# Altium schematic sheet KeyBoarDisplay.SchDoc
size A2
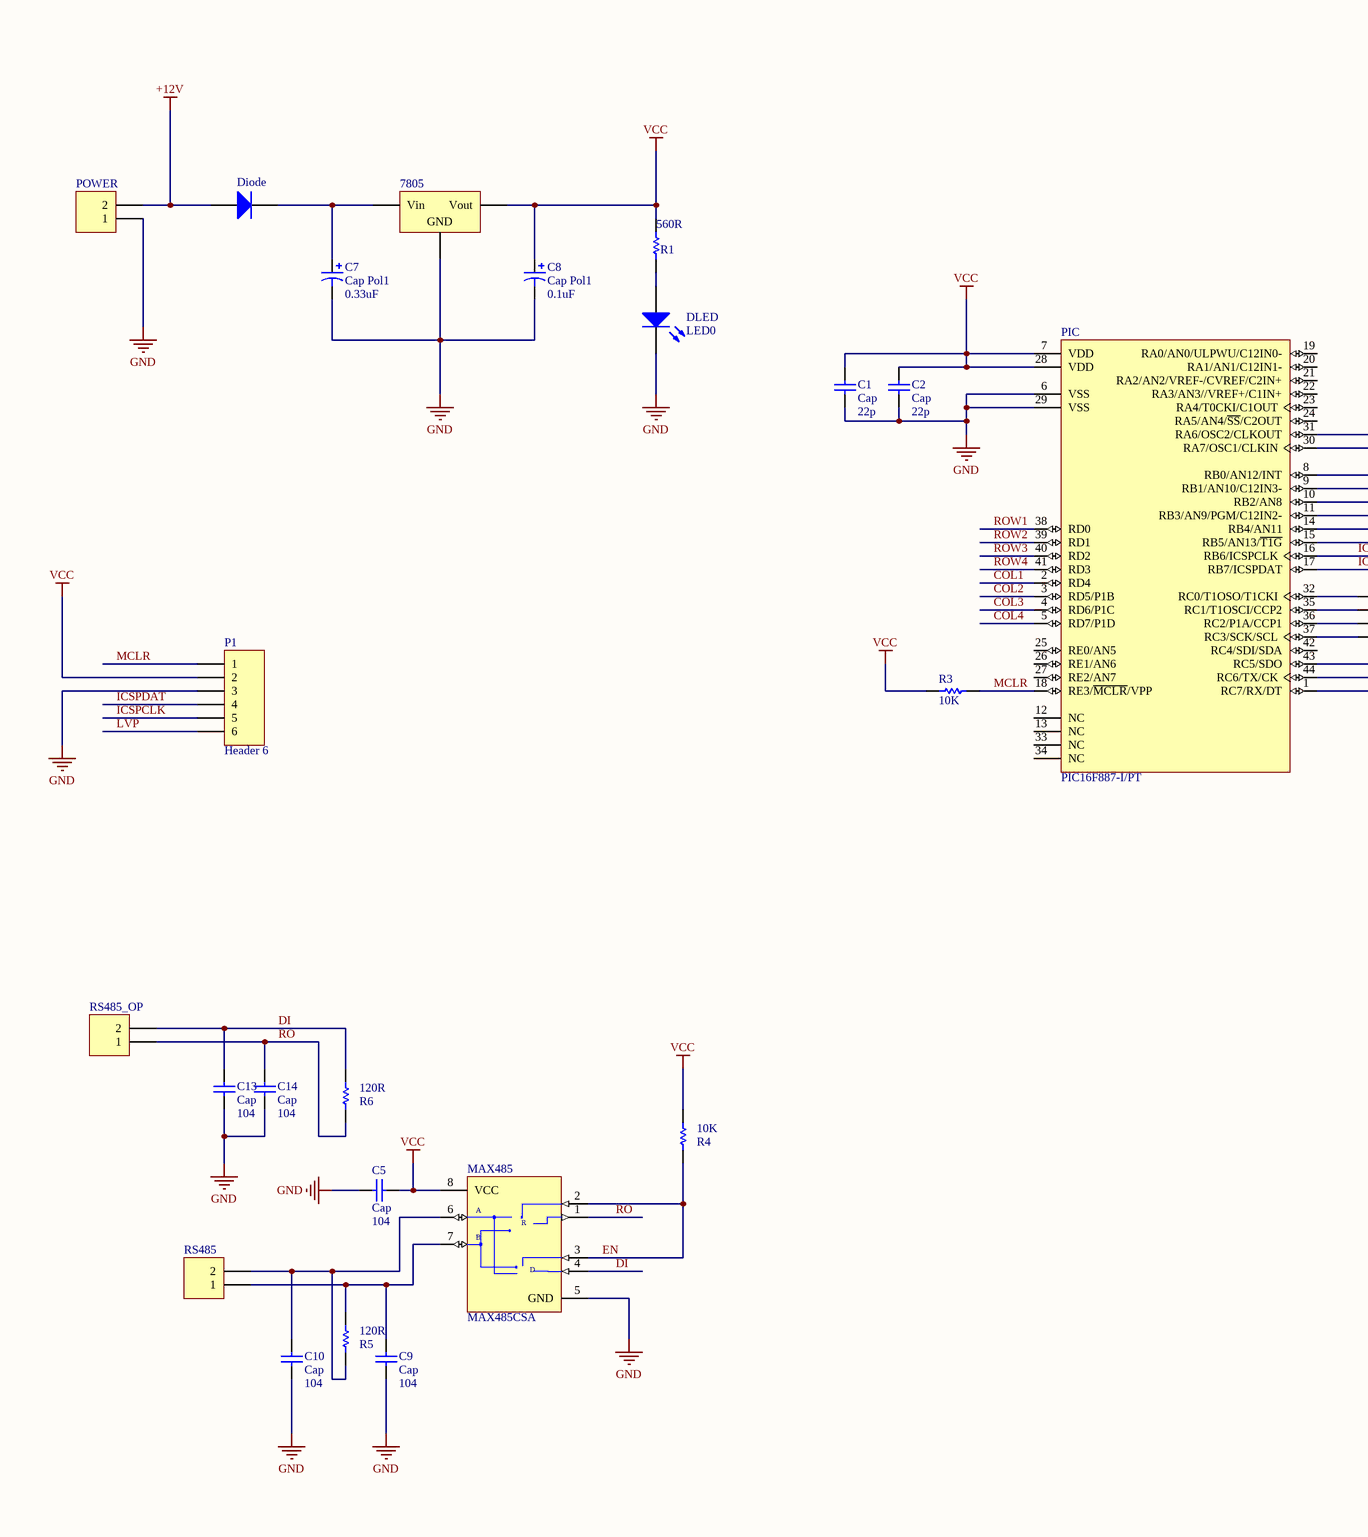
[diagram p0: KeyBoarDisplay.SchDoc, left]
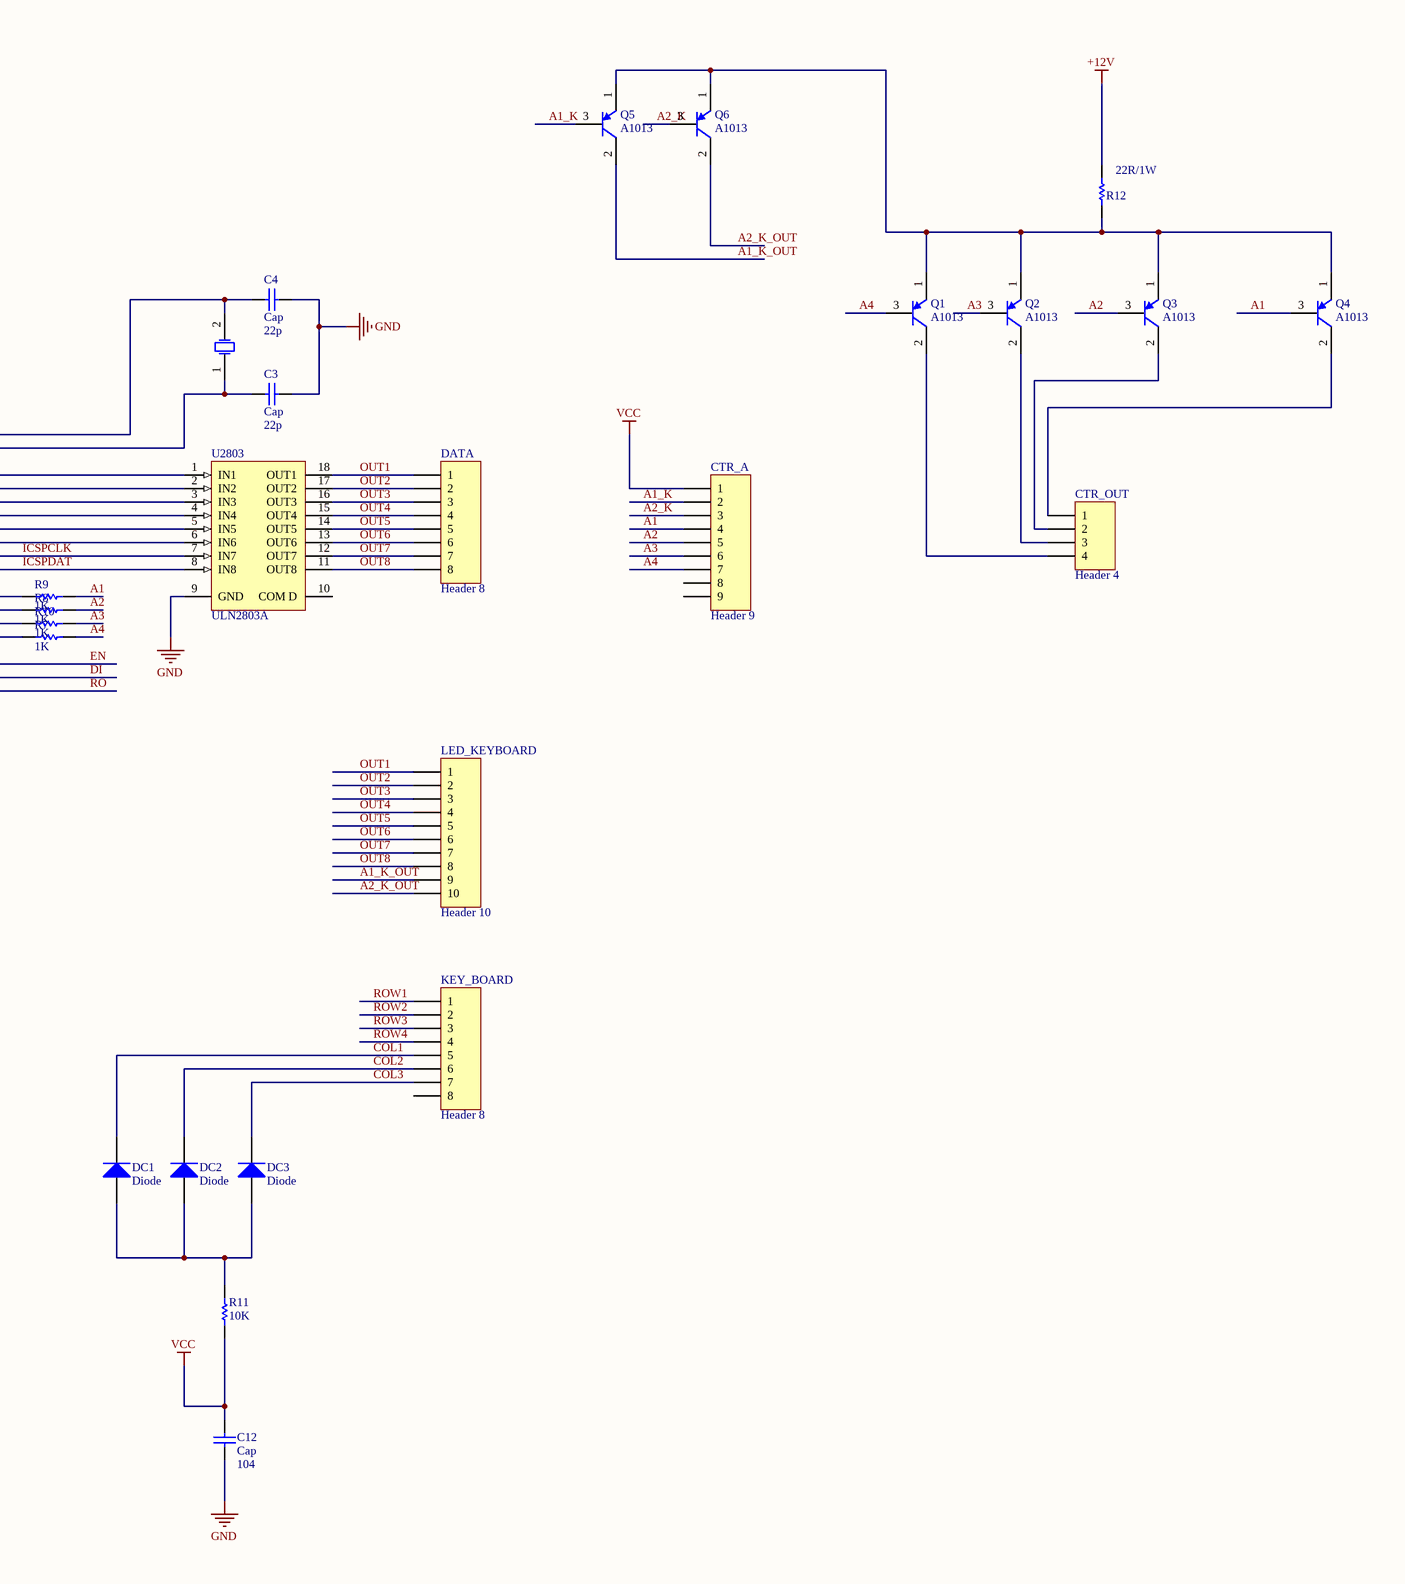
[diagram p1: KeyBoarDisplay.SchDoc, right]

## Parts
7805  Volt Reg  [78xx_NO]  (value not drawn)
?  XTAL  [Xtal12M]  (value not drawn)
C1  Cap  value 22p  [tu_gom]
C2  Cap  value 22p  [tu_gom]
C3  Cap  value 22p  [tu_gom]
C4  Cap  value 22p  [tu_gom]
C5  Cap  value 104  [tu_gom]
C7  Cap Pol1  value 0.33uF  [TU 470uF/50V]
C8  Cap Pol1  value 0.1uF  [tu 100uF/50v]
C9  Cap  value 104  [tu_gom]
C10  Cap  value 104  [tu_gom]
C12  Cap  value 104  [tu_gom]
C13  Cap  value 104  [tu_gom]
C14  Cap  value 104  [tu_gom]
CTR_A  Header 9  [HDR1X9]
CTR_OUT  Header 4  [CAP 4]
DATA  Header 8  [Cap_8]
DC1  Diode  [D_1A]
DC2  Diode  [D_1A]
DC3  Diode  [D_1A]
Diode  Diode  [D_2A]  (value not drawn)
DLED  LED0  [LED_3]
KEY_BOARD  Header 8  [Cap_8]
LED_KEYBOARD  Header 10  [CAP_10]
MAX485  MAX485CSA  [NSO8_N]
P1  Header 6  [HDR1X6]
PIC  PIC16F887-I/PT  [TQFP-PT44_N]
POWER  Header 2  [Header2 - duplicate]  (value not drawn)
Q1  A1013  [A1013]
Q2  A1013  [A1013]
Q3  A1013  [A1013]
Q4  A1013  [A1013]
Q5  A1013  [A1013]
Q6  A1013  [A1013]
R1  560R  [R_Nor]
R3  10K  [R_Nor]
R4  10K  [R_Nor]
R5  120R  [R_Nor]
R6  120R  [R_Nor]
R7  1K  [R_Nor]
R8  1K  [R_Nor]
R9  1K  [R_Nor]
R10  1K  [R_Nor]
R11  10K  [R_Nor]
R12  22R/1W  [R_CS220/470/1W]
RS485  Header 2  [Header2 - duplicate]  (value not drawn)
RS485_OP  Header 2  [Header2 - duplicate]  (value not drawn)
U2803  ULN2803A  [DIP18]

## Nets
+12V: Diode.1(A) POWER.2 R12.2
GND: 7805.2(GND) C1.1 C2.1 C3.2 C4.2 C5.1 C7.2 C8.2 C9.1 C10.1 C12.1 C13.1 C14.1 DLED.2(K) MAX485.5(GND) P1.3 PIC.6(VSS) PIC.29(VSS) POWER.1 U2803.9(GND)
VCC: 7805.3(Vout) C1.2 C2.2 C5.2 C8.1 C12.2 CTR_A.1 MAX485.8(VCC) P1.2 PIC.7(VDD) PIC.28(VDD) R1.2 R3.2 R4.2 R11.2
A1: CTR_A.4 Q4.3(B) R9.2
A1_K: CTR_A.2 Q5.3(B)
A1_K_OUT: LED_KEYBOARD.9 Q5.2(C)
A2: CTR_A.5 Q3.3(B) R8.2
A2_K: CTR_A.3 Q6.3(B)
A2_K_OUT: LED_KEYBOARD.10 Q6.2(C)
A3: CTR_A.6 Q2.3(B) R10.2
A4: CTR_A.7 Q1.3(B) R7.2
COL1: DC1.2(K) KEY_BOARD.5 PIC.2(RD4)
COL2: DC2.2(K) KEY_BOARD.6 PIC.3(RD5/P1B)
COL3: DC3.2(K) KEY_BOARD.7 PIC.4(RD6/P1C)
COL4: PIC.5(RD7/P1D)
DI: C13.2 MAX485.4(DI) PIC.44(RC6/TX/CK) R6.2 RS485_OP.2
EN: MAX485.2(~{RE}) MAX485.3(DE) PIC.43(RC5/SDO) R4.1
ICSPCLK: P1.5 PIC.16(RB6/ICSPCLK) U2803.7(IN7)
ICSPDAT: P1.4 PIC.17(RB7/ICSPDAT) U2803.8(IN8)
LVP: P1.6
MCLR: P1.1 PIC.18(RE3/~{MCLR}/VPP) R3.1
OUT1: DATA.1 LED_KEYBOARD.1 U2803.18(OUT1)
OUT2: DATA.2 LED_KEYBOARD.2 U2803.17(OUT2)
OUT3: DATA.3 LED_KEYBOARD.3 U2803.16(OUT3)
OUT4: DATA.4 LED_KEYBOARD.4 U2803.15(OUT4)
OUT5: DATA.5 LED_KEYBOARD.5 U2803.14(OUT5)
OUT6: DATA.6 LED_KEYBOARD.6 U2803.13(OUT6)
OUT7: DATA.7 LED_KEYBOARD.7 U2803.12(OUT7)
OUT8: DATA.8 LED_KEYBOARD.8 U2803.11(OUT8)
RO: C14.2 MAX485.1(RO) PIC.1(RC7/RX/DT) R6.1 RS485_OP.1
ROW1: KEY_BOARD.1 PIC.38(RD0)
ROW2: KEY_BOARD.2 PIC.39(RD1)
ROW3: KEY_BOARD.3 PIC.40(RD2)
ROW4: KEY_BOARD.4 PIC.41(RD3)
Net7805_1: 7805.1(Vin) C7.1 Diode.2(K)
Net?_1: ?.1(OSC1) C3.1 PIC.30(RA7/OSC1/CLKIN)
Net?_2: ?.2(OSC2) C4.1 PIC.31(RA6/OSC2/CLKOUT)
NetC9_2: C9.2 MAX485.7(B) R5.2 RS485.1
NetC10_2: C10.2 MAX485.6(A) R5.1 RS485.2
NetCTR_OUT_1: CTR_OUT.1 Q4.2(C)
NetCTR_OUT_2: CTR_OUT.2 Q3.2(C)
NetCTR_OUT_3: CTR_OUT.3 Q2.2(C)
NetCTR_OUT_4: CTR_OUT.4 Q1.2(C)
NetDC1_1: DC1.1(A) DC2.1(A) DC3.1(A) R11.1
NetDLED_1: DLED.1(A) R1.1
NetPIC_8: PIC.8(RB0/AN12/INT) U2803.1(IN1)
NetPIC_9: PIC.9(RB1/AN10/C12IN3-) U2803.2(IN2)
NetPIC_10: PIC.10(RB2/AN8) U2803.3(IN3)
NetPIC_11: PIC.11(RB3/AN9/PGM/C12IN2-) U2803.4(IN4)
NetPIC_14: PIC.14(RB4/AN11) U2803.5(IN5)
NetPIC_15: PIC.15(RB5/AN13/~{T1G}) U2803.6(IN6)
NetPIC_32: PIC.32(RC0/T1OSO/T1CKI) R9.1
NetPIC_35: PIC.35(RC1/T1OSCI/CCP2) R8.1
NetPIC_36: PIC.36(RC2/P1A/CCP1) R10.1
NetPIC_37: PIC.37(RC3/SCK/SCL) R7.1
NetQ1_1: Q1.1(E) Q2.1(E) Q3.1(E) Q4.1(E) Q5.1(E) Q6.1(E) R12.1

Not connected (* = marked no-connect by the designer): CTR_A 8 9; KEY_BOARD 8; PIC 12(NC) 13(NC) 19(RA0/AN0/ULPWU/C12IN0-) 20(RA1/AN1/C12IN1-) 21(RA2/AN2/VREF-/CVREF/C2IN+) 22(RA3/AN3//VREF+/C1IN+) 23(RA4/T0CKI/C1OUT) 24(RA5/AN4/~{SS}/C2OUT) 25(RE0/AN5) 26(RE1/AN6) 27(RE2/AN7) 33(NC) 34(NC) 42(RC4/SDI/SDA); U2803 10(COM_D)

## Notes on the sheet
- (in symbol MAX485CSA) R; D

## Library data of the parts
7805 = Volt Reg: Voltage Regulator; Published: 24-Mar-1999; LatestRevisionDate: 29-May-2009; LatestRevisionNote: IPC-7351 Footprint Added.; PackageReference: D2PAK; Publisher: Altium Limited; PackageDescription: 3-Pin Transistor Outline Package 2.54 mm Pitch, 15.1 mm Lead Span
? = XTAL: Crystal Oscillator; Published: 8-Jun-2000; LatestRevisionDate: 17-Jul-2002; LatestRevisionNote: Re-released for DXP Platform.; PackageReference: R38; Publisher: Altium Limited
C1-C5 C9 C10 C12-C14 = Ceramic: Capcitor
C7 C8 = Cap Pol1: Polarized Capacitor (Radial); Published: 8-Jun-2000; LatestRevisionDate: 17-Jul-2002; LatestRevisionNote: Re-released for DXP Platform.; PackageReference: RB7.6-15; Publisher: Altium Limited
CTR_A = Header 9: Header, 9-Pin; LatestRevisionDate: 17-Jul-2002; LatestRevisionNote: Re-released for DXP Platform.; Publisher: Altium Limited
CTR_OUT = Header 4: Header, 4-Pin; LatestRevisionDate: 17-Jul-2002; LatestRevisionNote: Re-released for DXP Platform.; Publisher: Altium Limited
DATA KEY_BOARD = Header 8: Header, 8-Pin; LatestRevisionDate: 17-Jul-2002; LatestRevisionNote: Re-released for DXP Platform.; Publisher: Altium Limited
DC1-DC3 Diode = Diode: Default Diode; Published: 8-Jun-2000; LatestRevisionDate: 17-Jul-2002; LatestRevisionNote: Re-released for DXP Platform.; PackageVersion: Sep-1996; PackageReference: SMC; Publisher: Altium Limited; Code_JEDEC: DO-214-AB
DLED = LED0: Typical INFRARED GaAs LED; Published: 8-Jun-2000; LatestRevisionDate: 08-Jul-2005; LatestRevisionNote: Mech Layer 1 removed.; PackageReference: LED-0; Publisher: Altium Limited
LED_KEYBOARD = Header 10: Header, 10-Pin; LatestRevisionDate: 17-Jul-2002; LatestRevisionNote: Re-released for DXP Platform.; Publisher: Altium Limited
MAX485 = MAX485CSA: Low-Power, Slew-Rate-Limited RS-485/RS-422 Transceiver; Published: 16-Jan-2001; LatestRevisionDate: 13-Apr-2006; LatestRevisionNote: IPC-7351 Footprint Added.; DatasheetVersion: Feb-1996; PackageReference: NSO8; Publisher: Altium Limited; PackageDescription: 8-Pin Small Outline Integrated Circuit 1.27 mm Pitch; Code_JEDEC: MS-012-AA; Code_IPC: SOIC127P600-8; ComponentLink1Description: Manufacturer Link; ComponentLink1URL: http://www.maxim-ic.com/; ComponentLink2Description: Datasheet; ComponentLink2URL: http://pdfserv.maxim-ic.com/en/ds/MAX1487-MAX491.pdf
P1 = Header 6: Header, 6-Pin; LatestRevisionDate: 17-Jul-2002; LatestRevisionNote: Re-released for DXP Platform.; Publisher: Altium Limited
PIC = PIC16F887-I/PT: Flash-Based, 8-Bit CMOS Microcontroller with nanoWatt Technology, 8K (x14-Bit words) Program Memory, 624 Bytes Data Memory, 35 I/O pins, 44-Pin TQFP, Standard VDD Range, Industrial Temperature; FirstPublished: 29-Jan-2009; LatestRevisionDate: 02-Dec-2009; LatestRevisionNote: Updated datasheet to version revF, Apr-2009.; DatasheetVersion: revF, Apr-2009; PackageVersion: revBB, Aug-2009; PackageReference: TQFP-PT44; Publisher: Altium Limited; PackageDescription: 44-Lead Plastic Thin Quad Flatpack (PT) - 10x10x1mm Body, 2.00mm [TQFP]; Supplier 1: Digi-Key; Supplier Part Number 1: PIC16F887-I/PT-ND; Supplier 2: Farnell; Supplier Part Number 2: 1668740; Supplier 3: Farnell; Supplier Part Number 3: 1439542; Supplier 4: Newark; Supplier Part Number 4: 74K8587; Code_JEDEC: MS-026; ComponentLink1Description: Datasheet; ComponentLink1URL: http://ww1.microchip.com/downloads/en/DeviceDoc/41291F.pdf; ComponentLink2Description: Packaging Specification; ComponentLink2URL: http://www.microchip.com/stellent/groups/techpub_sg/documents/packagingspec/en012702.pdf; ComponentLink3Description: Microchip.com Home; ComponentLink3URL: http://www.microchip.com/
POWER RS485 RS485_OP = Header 2: Header, 2-Pin; LatestRevisionDate: 17-Jul-2002; LatestRevisionNote: Re-released for DXP Platform.; Publisher: Altium Limited
Q1-Q6 = PNP: PNP Bipolar Transistor; Published: 8-Jun-2000; LatestRevisionDate: 29-May-2009; LatestRevisionNote: IPC-7351 Footprint Added.; PackageVersion: Aug-1999; PackageReference: SOT-23B; Publisher: Altium Limited; PackageDescription: 3-Pin SOT-23 Package 0.95 mm Pitch, 2.4 mm Lead Span
R1 R3-R12 = Res
U2803 = ULN2803A: Eight Darlington Array; Published: 8-Jun-2000; LatestRevisionDate: 06-Jun-2005; LatestRevisionNote: Stylized 3D Model Added.; DatasheetVersion: Sep-1997; PackageReference: DIP18; Publisher: Altium Limited; PackageDescription: DIP; 18 Leads; Row Spacing 7.62 mm; Pitch 2.54 mm; ComponentLink1Description: Manufacturer Link; ComponentLink1URL: http://www.st.com/; ComponentLink2Description: Datasheet; ComponentLink2URL: http://www.st.com/stonline/products/literature/ds/1536/uln2801a.pdf